# EAGLE schematic rc_filter_v1-xld50 (EAGLE 9.3.0)
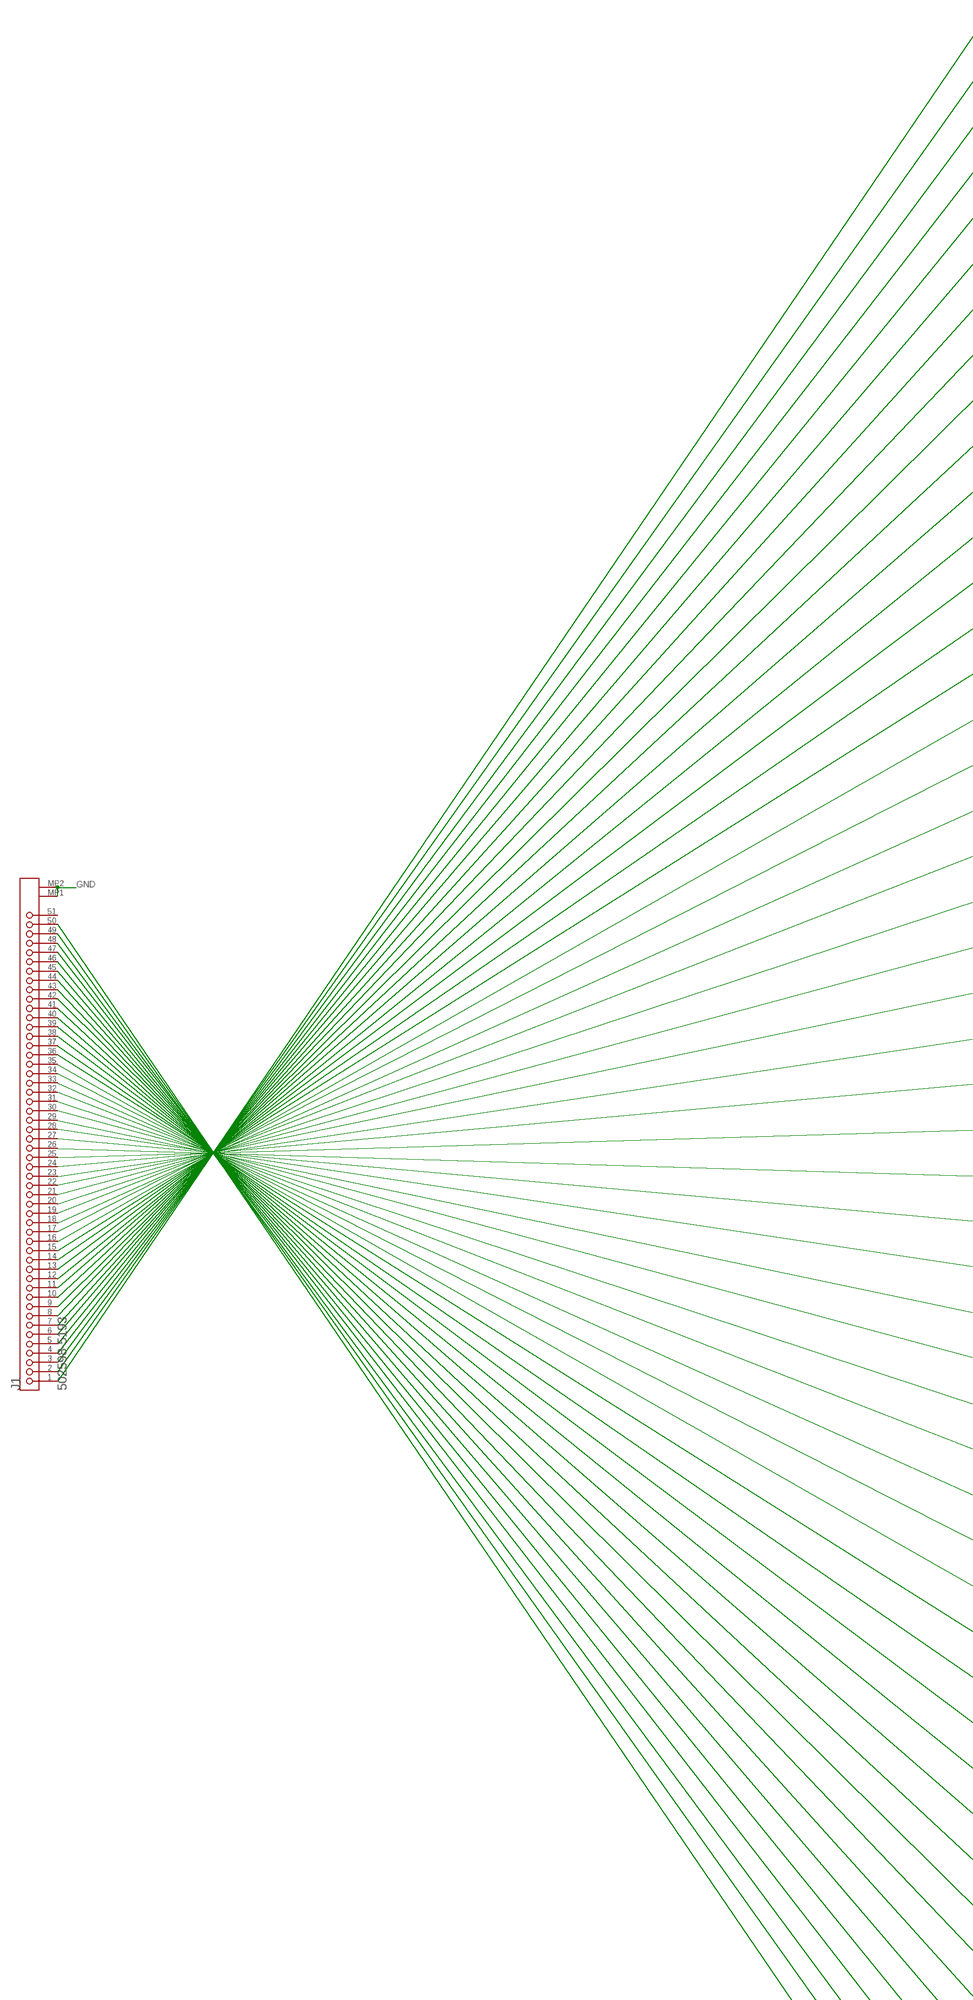
[diagram p0: schematic, sheet 1, part 1 of 3]
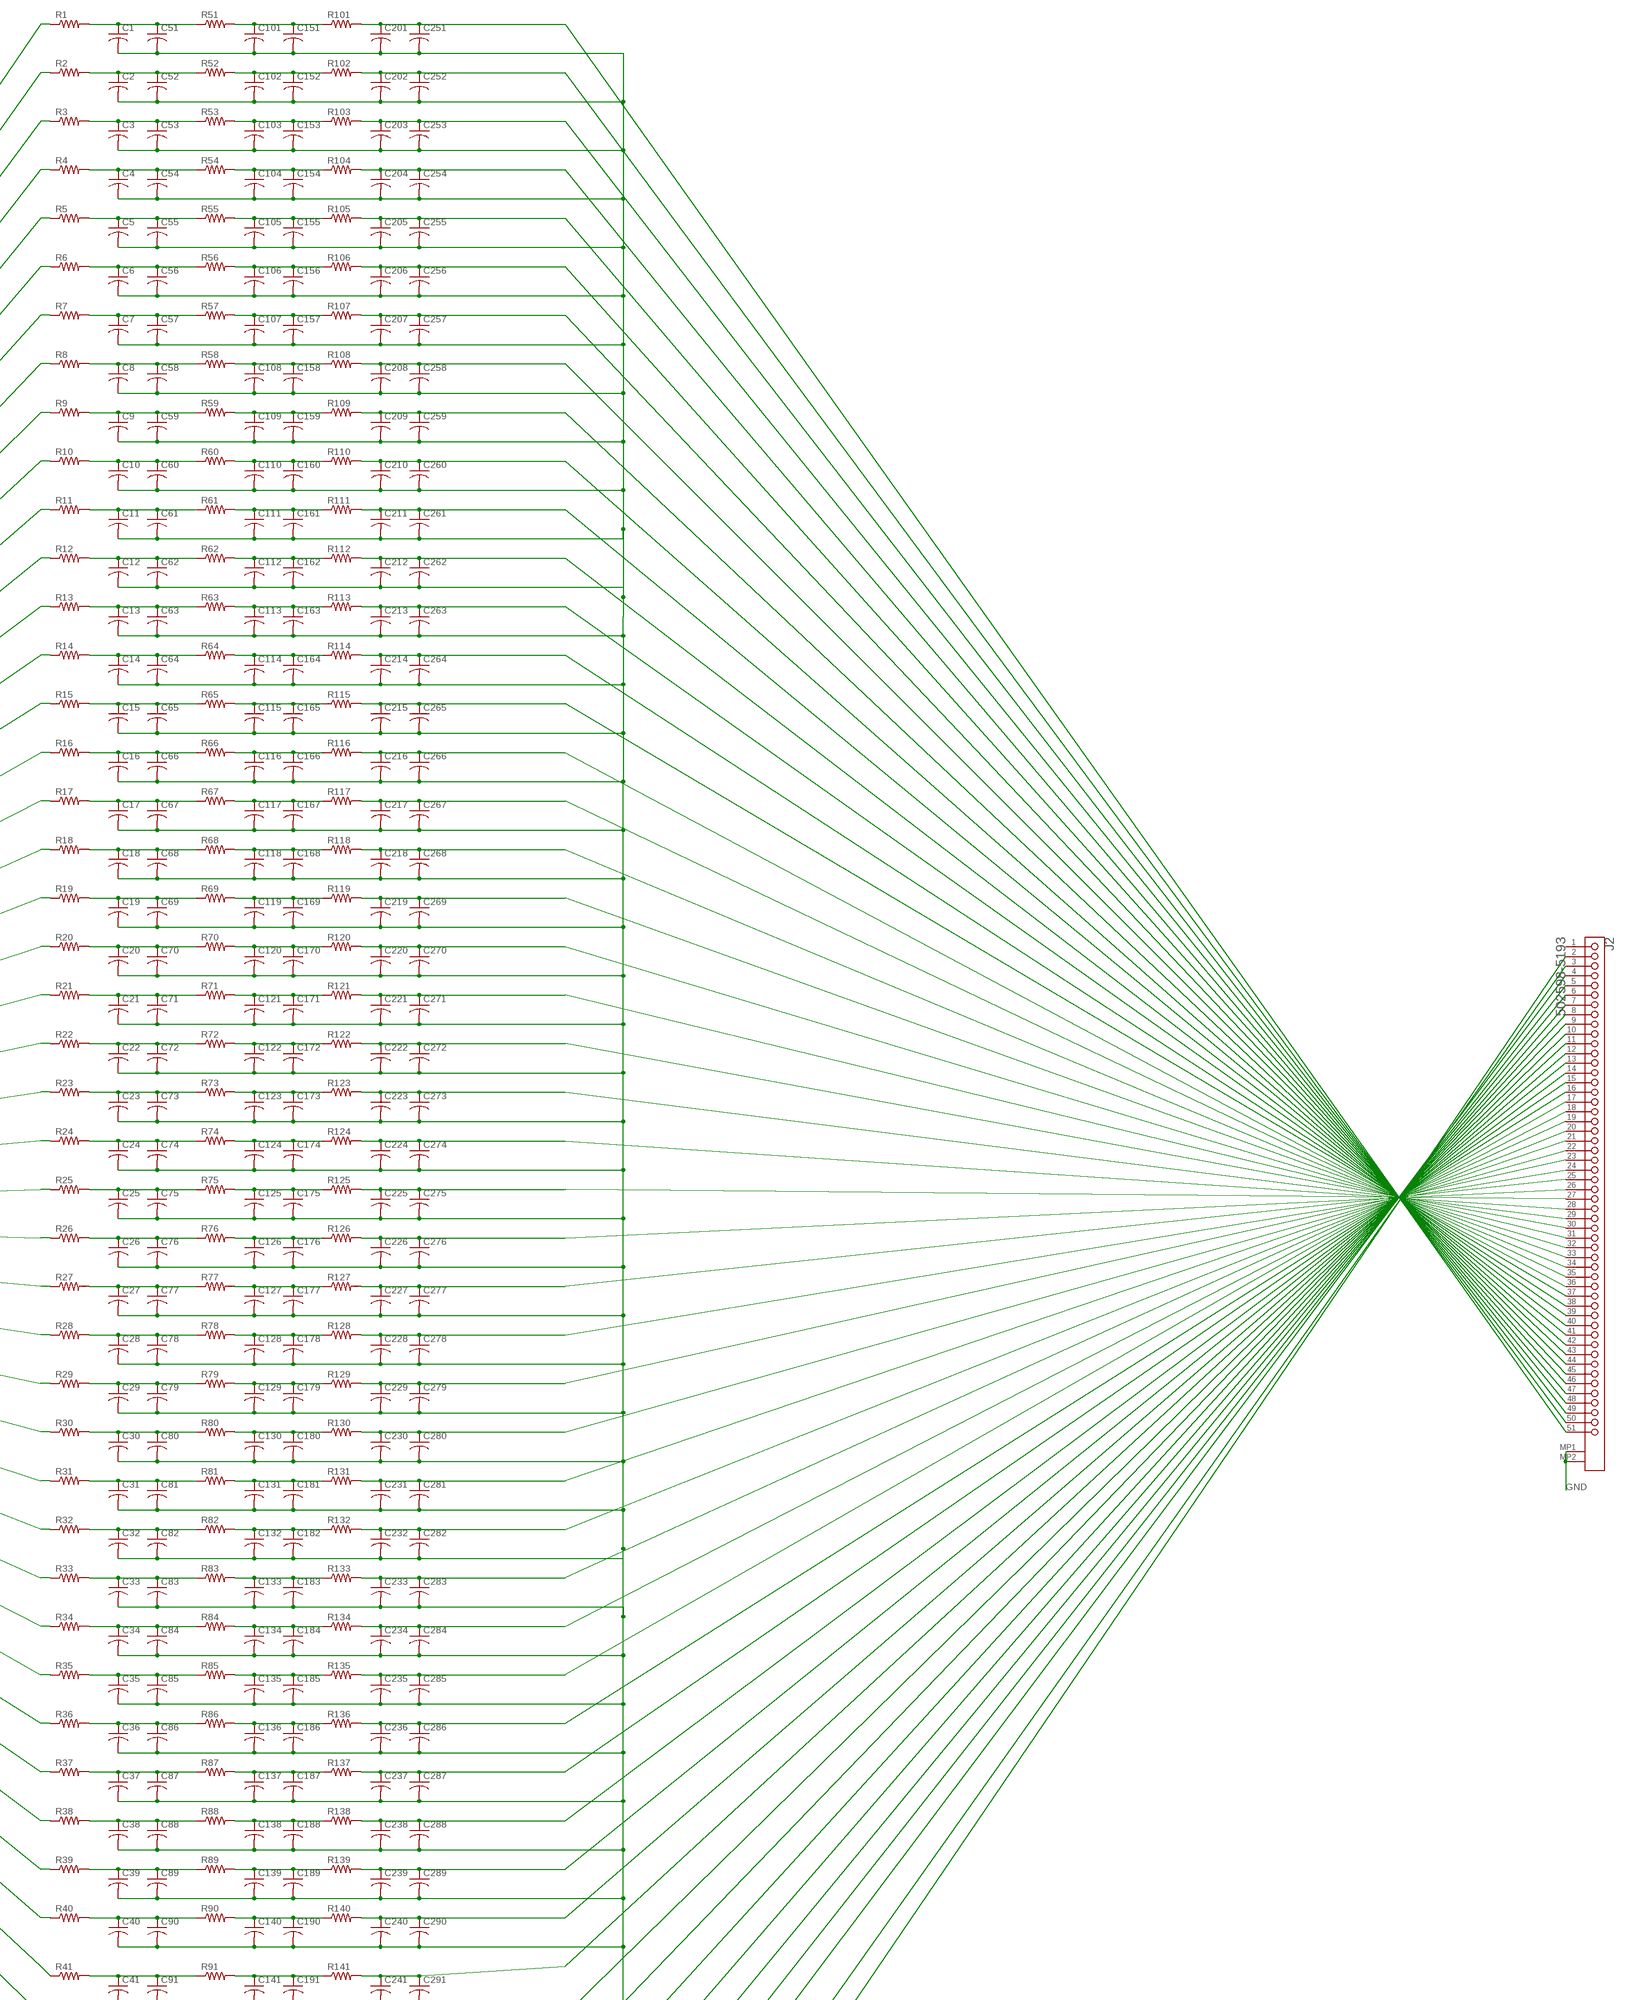
[diagram p1: schematic, sheet 1, part 2 of 3]
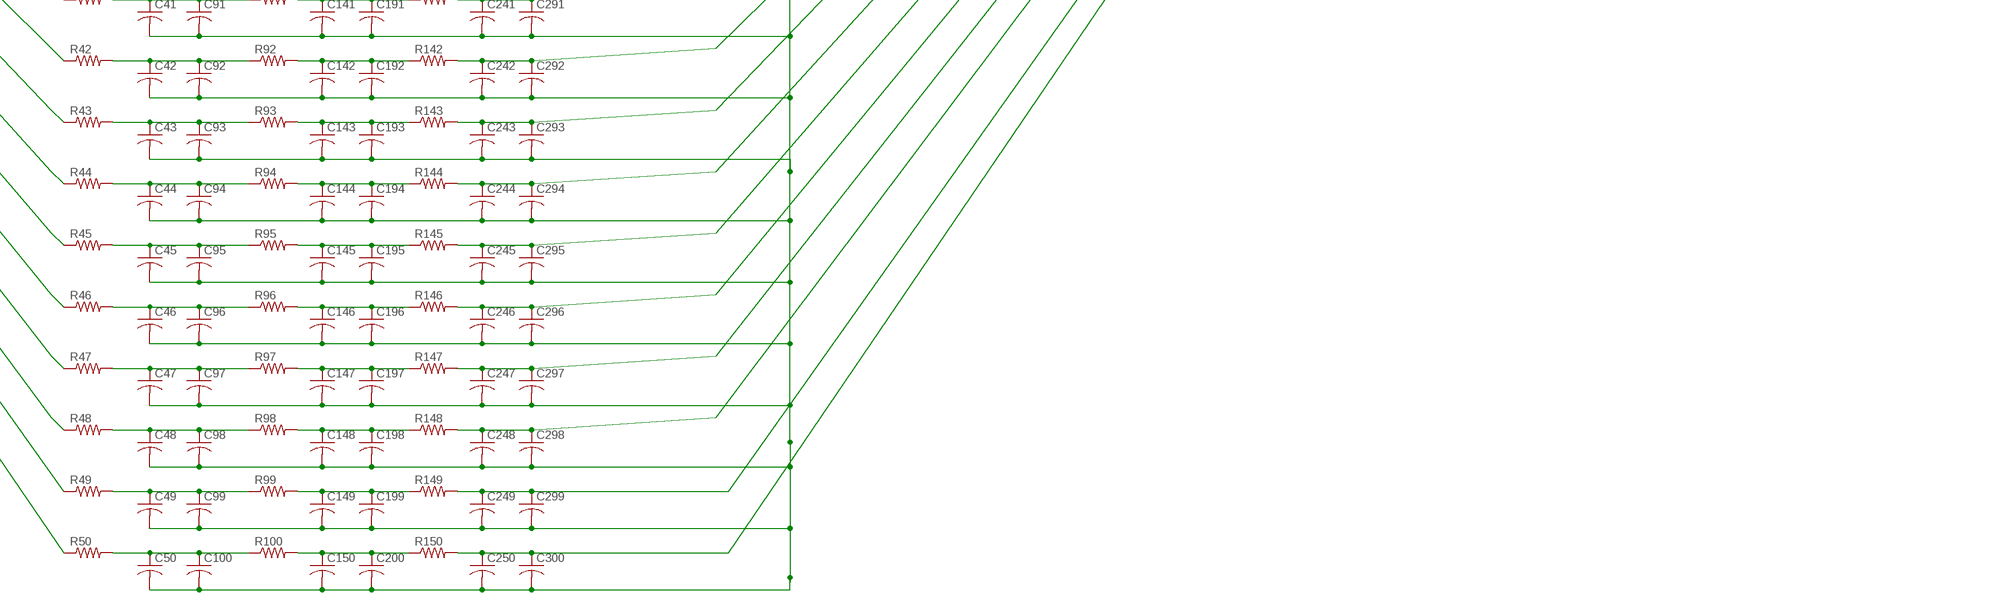
[diagram p2: schematic, sheet 1, part 3 of 3]

## Parts
C1  C-USC0402  [C0402]
C2  C-USC0402  [C0402]
C3  C-USC0402  [C0402]
C4  C-USC0402  [C0402]
C5  C-USC0402  [C0402]
C6  C-USC0402  [C0402]
C7  C-USC0402  [C0402]
C8  C-USC0402  [C0402]
C9  C-USC0402  [C0402]
C10  C-USC0402  [C0402]
C11  C-USC0402  [C0402]
C12  C-USC0402  [C0402]
C13  C-USC0402  [C0402]
C14  C-USC0402  [C0402]
C15  C-USC0402  [C0402]
C16  C-USC0402  [C0402]
C17  C-USC0402  [C0402]
C18  C-USC0402  [C0402]
C19  C-USC0402  [C0402]
C20  C-USC0402  [C0402]
C21  C-USC0402  [C0402]
C22  C-USC0402  [C0402]
C23  C-USC0402  [C0402]
C24  C-USC0402  [C0402]
C25  C-USC0402  [C0402]
C26  C-USC0402  [C0402]
C27  C-USC0402  [C0402]
C28  C-USC0402  [C0402]
C29  C-USC0402  [C0402]
C30  C-USC0402  [C0402]
C31  C-USC0402  [C0402]
C32  C-USC0402  [C0402]
C33  C-USC0402  [C0402]
C34  C-USC0402  [C0402]
C35  C-USC0402  [C0402]
C36  C-USC0402  [C0402]
C37  C-USC0402  [C0402]
C38  C-USC0402  [C0402]
C39  C-USC0402  [C0402]
C40  C-USC0402  [C0402]
C41  C-USC0402  [C0402]
C42  C-USC0402  [C0402]
C43  C-USC0402  [C0402]
C44  C-USC0402  [C0402]
C45  C-USC0402  [C0402]
C46  C-USC0402  [C0402]
C47  C-USC0402  [C0402]
C48  C-USC0402  [C0402]
C49  C-USC0402  [C0402]
C50  C-USC0402  [C0402]
C51  C-USC0402  [C0402]
C52  C-USC0402  [C0402]
C53  C-USC0402  [C0402]
C54  C-USC0402  [C0402]
C55  C-USC0402  [C0402]
C56  C-USC0402  [C0402]
C57  C-USC0402  [C0402]
C58  C-USC0402  [C0402]
C59  C-USC0402  [C0402]
C60  C-USC0402  [C0402]
C61  C-USC0402  [C0402]
C62  C-USC0402  [C0402]
C63  C-USC0402  [C0402]
C64  C-USC0402  [C0402]
C65  C-USC0402  [C0402]
C66  C-USC0402  [C0402]
C67  C-USC0402  [C0402]
C68  C-USC0402  [C0402]
C69  C-USC0402  [C0402]
C70  C-USC0402  [C0402]
C71  C-USC0402  [C0402]
C72  C-USC0402  [C0402]
C73  C-USC0402  [C0402]
C74  C-USC0402  [C0402]
C75  C-USC0402  [C0402]
C76  C-USC0402  [C0402]
C77  C-USC0402  [C0402]
C78  C-USC0402  [C0402]
C79  C-USC0402  [C0402]
C80  C-USC0402  [C0402]
C81  C-USC0402  [C0402]
C82  C-USC0402  [C0402]
C83  C-USC0402  [C0402]
C84  C-USC0402  [C0402]
C85  C-USC0402  [C0402]
C86  C-USC0402  [C0402]
C87  C-USC0402  [C0402]
C88  C-USC0402  [C0402]
C89  C-USC0402  [C0402]
C90  C-USC0402  [C0402]
C91  C-USC0402  [C0402]
C92  C-USC0402  [C0402]
C93  C-USC0402  [C0402]
C94  C-USC0402  [C0402]
C95  C-USC0402  [C0402]
C96  C-USC0402  [C0402]
C97  C-USC0402  [C0402]
C98  C-USC0402  [C0402]
C99  C-USC0402  [C0402]
C100  C-USC0402  [C0402]
C101  C-USC0402  [C0402]
C102  C-USC0402  [C0402]
C103  C-USC0402  [C0402]
C104  C-USC0402  [C0402]
C105  C-USC0402  [C0402]
C106  C-USC0402  [C0402]
C107  C-USC0402  [C0402]
C108  C-USC0402  [C0402]
C109  C-USC0402  [C0402]
C110  C-USC0402  [C0402]
C111  C-USC0402  [C0402]
C112  C-USC0402  [C0402]
C113  C-USC0402  [C0402]
C114  C-USC0402  [C0402]
C115  C-USC0402  [C0402]
C116  C-USC0402  [C0402]
C117  C-USC0402  [C0402]
C118  C-USC0402  [C0402]
C119  C-USC0402  [C0402]
C120  C-USC0402  [C0402]
C121  C-USC0402  [C0402]
C122  C-USC0402  [C0402]
C123  C-USC0402  [C0402]
C124  C-USC0402  [C0402]
C125  C-USC0402  [C0402]
C126  C-USC0402  [C0402]
C127  C-USC0402  [C0402]
C128  C-USC0402  [C0402]
C129  C-USC0402  [C0402]
C130  C-USC0402  [C0402]
C131  C-USC0402  [C0402]
C132  C-USC0402  [C0402]
C133  C-USC0402  [C0402]
C134  C-USC0402  [C0402]
C135  C-USC0402  [C0402]
C136  C-USC0402  [C0402]
C137  C-USC0402  [C0402]
C138  C-USC0402  [C0402]
C139  C-USC0402  [C0402]
C140  C-USC0402  [C0402]
C141  C-USC0402  [C0402]
C142  C-USC0402  [C0402]
C143  C-USC0402  [C0402]
C144  C-USC0402  [C0402]
C145  C-USC0402  [C0402]
C146  C-USC0402  [C0402]
C147  C-USC0402  [C0402]
C148  C-USC0402  [C0402]
C149  C-USC0402  [C0402]
C150  C-USC0402  [C0402]
C151  C-USC0402  [C0402]
C152  C-USC0402  [C0402]
C153  C-USC0402  [C0402]
C154  C-USC0402  [C0402]
C155  C-USC0402  [C0402]
C156  C-USC0402  [C0402]
C157  C-USC0402  [C0402]
C158  C-USC0402  [C0402]
C159  C-USC0402  [C0402]
C160  C-USC0402  [C0402]
C161  C-USC0402  [C0402]
C162  C-USC0402  [C0402]
C163  C-USC0402  [C0402]
C164  C-USC0402  [C0402]
C165  C-USC0402  [C0402]
C166  C-USC0402  [C0402]
C167  C-USC0402  [C0402]
C168  C-USC0402  [C0402]
C169  C-USC0402  [C0402]
C170  C-USC0402  [C0402]
C171  C-USC0402  [C0402]
C172  C-USC0402  [C0402]
C173  C-USC0402  [C0402]
C174  C-USC0402  [C0402]
C175  C-USC0402  [C0402]
C176  C-USC0402  [C0402]
C177  C-USC0402  [C0402]
C178  C-USC0402  [C0402]
C179  C-USC0402  [C0402]
C180  C-USC0402  [C0402]
C181  C-USC0402  [C0402]
C182  C-USC0402  [C0402]
C183  C-USC0402  [C0402]
C184  C-USC0402  [C0402]
C185  C-USC0402  [C0402]
C186  C-USC0402  [C0402]
C187  C-USC0402  [C0402]
C188  C-USC0402  [C0402]
C189  C-USC0402  [C0402]
C190  C-USC0402  [C0402]
C191  C-USC0402  [C0402]
C192  C-USC0402  [C0402]
C193  C-USC0402  [C0402]
C194  C-USC0402  [C0402]
C195  C-USC0402  [C0402]
C196  C-USC0402  [C0402]
C197  C-USC0402  [C0402]
C198  C-USC0402  [C0402]
C199  C-USC0402  [C0402]
C200  C-USC0402  [C0402]
C201  C-USC0402  [C0402]
C202  C-USC0402  [C0402]
C203  C-USC0402  [C0402]
C204  C-USC0402  [C0402]
C205  C-USC0402  [C0402]
C206  C-USC0402  [C0402]
C207  C-USC0402  [C0402]
C208  C-USC0402  [C0402]
C209  C-USC0402  [C0402]
C210  C-USC0402  [C0402]
C211  C-USC0402  [C0402]
C212  C-USC0402  [C0402]
C213  C-USC0402  [C0402]
C214  C-USC0402  [C0402]
C215  C-USC0402  [C0402]
C216  C-USC0402  [C0402]
C217  C-USC0402  [C0402]
C218  C-USC0402  [C0402]
C219  C-USC0402  [C0402]
C220  C-USC0402  [C0402]
C221  C-USC0402  [C0402]
C222  C-USC0402  [C0402]
C223  C-USC0402  [C0402]
C224  C-USC0402  [C0402]
C225  C-USC0402  [C0402]
C226  C-USC0402  [C0402]
C227  C-USC0402  [C0402]
C228  C-USC0402  [C0402]
C229  C-USC0402  [C0402]
C230  C-USC0402  [C0402]
C231  C-USC0402  [C0402]
C232  C-USC0402  [C0402]
C233  C-USC0402  [C0402]
C234  C-USC0402  [C0402]
C235  C-USC0402  [C0402]
C236  C-USC0402  [C0402]
C237  C-USC0402  [C0402]
C238  C-USC0402  [C0402]
C239  C-USC0402  [C0402]
C240  C-USC0402  [C0402]
C241  C-USC0402  [C0402]
C242  C-USC0402  [C0402]
C243  C-USC0402  [C0402]
C244  C-USC0402  [C0402]
C245  C-USC0402  [C0402]
C246  C-USC0402  [C0402]
C247  C-USC0402  [C0402]
C248  C-USC0402  [C0402]
C249  C-USC0402  [C0402]
C250  C-USC0402  [C0402]
C251  C-USC0402  [C0402]
C252  C-USC0402  [C0402]
C253  C-USC0402  [C0402]
C254  C-USC0402  [C0402]
C255  C-USC0402  [C0402]
C256  C-USC0402  [C0402]
C257  C-USC0402  [C0402]
C258  C-USC0402  [C0402]
C259  C-USC0402  [C0402]
C260  C-USC0402  [C0402]
C261  C-USC0402  [C0402]
C262  C-USC0402  [C0402]
C263  C-USC0402  [C0402]
C264  C-USC0402  [C0402]
C265  C-USC0402  [C0402]
C266  C-USC0402  [C0402]
C267  C-USC0402  [C0402]
C268  C-USC0402  [C0402]
C269  C-USC0402  [C0402]
C270  C-USC0402  [C0402]
C271  C-USC0402  [C0402]
C272  C-USC0402  [C0402]
C273  C-USC0402  [C0402]
C274  C-USC0402  [C0402]
C275  C-USC0402  [C0402]
C276  C-USC0402  [C0402]
C277  C-USC0402  [C0402]
C278  C-USC0402  [C0402]
C279  C-USC0402  [C0402]
C280  C-USC0402  [C0402]
C281  C-USC0402  [C0402]
C282  C-USC0402  [C0402]
C283  C-USC0402  [C0402]
C284  C-USC0402  [C0402]
C285  C-USC0402  [C0402]
C286  C-USC0402  [C0402]
C287  C-USC0402  [C0402]
C288  C-USC0402  [C0402]
C289  C-USC0402  [C0402]
C290  C-USC0402  [C0402]
C291  C-USC0402  [C0402]
C292  C-USC0402  [C0402]
C293  C-USC0402  [C0402]
C294  C-USC0402  [C0402]
C295  C-USC0402  [C0402]
C296  C-USC0402  [C0402]
C297  C-USC0402  [C0402]
C298  C-USC0402  [C0402]
C299  C-USC0402  [C0402]
C300  C-USC0402  [C0402]
J1  MOLEX_502598-5193MOLEX_502598-5193_0_0  [MOLEX_502598-5193_0]
J2  MOLEX_502598-5193MOLEX_502598-5193_0_0  [MOLEX_502598-5193_0]
R1  R-US_R0402  [R0402]
R2  R-US_R0402  [R0402]
R3  R-US_R0402  [R0402]
R4  R-US_R0402  [R0402]
R5  R-US_R0402  [R0402]
R6  R-US_R0402  [R0402]
R7  R-US_R0402  [R0402]
R8  R-US_R0402  [R0402]
R9  R-US_R0402  [R0402]
R10  R-US_R0402  [R0402]
R11  R-US_R0402  [R0402]
R12  R-US_R0402  [R0402]
R13  R-US_R0402  [R0402]
R14  R-US_R0402  [R0402]
R15  R-US_R0402  [R0402]
R16  R-US_R0402  [R0402]
R17  R-US_R0402  [R0402]
R18  R-US_R0402  [R0402]
R19  R-US_R0402  [R0402]
R20  R-US_R0402  [R0402]
R21  R-US_R0402  [R0402]
R22  R-US_R0402  [R0402]
R23  R-US_R0402  [R0402]
R24  R-US_R0402  [R0402]
R25  R-US_R0402  [R0402]
R26  R-US_R0402  [R0402]
R27  R-US_R0402  [R0402]
R28  R-US_R0402  [R0402]
R29  R-US_R0402  [R0402]
R30  R-US_R0402  [R0402]
R31  R-US_R0402  [R0402]
R32  R-US_R0402  [R0402]
R33  R-US_R0402  [R0402]
R34  R-US_R0402  [R0402]
R35  R-US_R0402  [R0402]
R36  R-US_R0402  [R0402]
R37  R-US_R0402  [R0402]
R38  R-US_R0402  [R0402]
R39  R-US_R0402  [R0402]
R40  R-US_R0402  [R0402]
R41  R-US_R0402  [R0402]
R42  R-US_R0402  [R0402]
R43  R-US_R0402  [R0402]
R44  R-US_R0402  [R0402]
R45  R-US_R0402  [R0402]
R46  R-US_R0402  [R0402]
R47  R-US_R0402  [R0402]
R48  R-US_R0402  [R0402]
R49  R-US_R0402  [R0402]
R50  R-US_R0402  [R0402]
R51  R-US_R0402  [R0402]
R52  R-US_R0402  [R0402]
R53  R-US_R0402  [R0402]
R54  R-US_R0402  [R0402]
R55  R-US_R0402  [R0402]
R56  R-US_R0402  [R0402]
R57  R-US_R0402  [R0402]
R58  R-US_R0402  [R0402]
R59  R-US_R0402  [R0402]
R60  R-US_R0402  [R0402]
R61  R-US_R0402  [R0402]
R62  R-US_R0402  [R0402]
R63  R-US_R0402  [R0402]
R64  R-US_R0402  [R0402]
R65  R-US_R0402  [R0402]
R66  R-US_R0402  [R0402]
R67  R-US_R0402  [R0402]
R68  R-US_R0402  [R0402]
R69  R-US_R0402  [R0402]
R70  R-US_R0402  [R0402]
R71  R-US_R0402  [R0402]
R72  R-US_R0402  [R0402]
R73  R-US_R0402  [R0402]
R74  R-US_R0402  [R0402]
R75  R-US_R0402  [R0402]
R76  R-US_R0402  [R0402]
R77  R-US_R0402  [R0402]
R78  R-US_R0402  [R0402]
R79  R-US_R0402  [R0402]
R80  R-US_R0402  [R0402]
R81  R-US_R0402  [R0402]
R82  R-US_R0402  [R0402]
R83  R-US_R0402  [R0402]
R84  R-US_R0402  [R0402]
R85  R-US_R0402  [R0402]
R86  R-US_R0402  [R0402]
R87  R-US_R0402  [R0402]
R88  R-US_R0402  [R0402]
R89  R-US_R0402  [R0402]
R90  R-US_R0402  [R0402]
R91  R-US_R0402  [R0402]
R92  R-US_R0402  [R0402]
R93  R-US_R0402  [R0402]
R94  R-US_R0402  [R0402]
R95  R-US_R0402  [R0402]
R96  R-US_R0402  [R0402]
R97  R-US_R0402  [R0402]
R98  R-US_R0402  [R0402]
R99  R-US_R0402  [R0402]
R100  R-US_R0402  [R0402]
R101  R-US_R0402  [R0402]
R102  R-US_R0402  [R0402]
R103  R-US_R0402  [R0402]
R104  R-US_R0402  [R0402]
R105  R-US_R0402  [R0402]
R106  R-US_R0402  [R0402]
R107  R-US_R0402  [R0402]
R108  R-US_R0402  [R0402]
R109  R-US_R0402  [R0402]
R110  R-US_R0402  [R0402]
R111  R-US_R0402  [R0402]
R112  R-US_R0402  [R0402]
R113  R-US_R0402  [R0402]
R114  R-US_R0402  [R0402]
R115  R-US_R0402  [R0402]
R116  R-US_R0402  [R0402]
R117  R-US_R0402  [R0402]
R118  R-US_R0402  [R0402]
R119  R-US_R0402  [R0402]
R120  R-US_R0402  [R0402]
R121  R-US_R0402  [R0402]
R122  R-US_R0402  [R0402]
R123  R-US_R0402  [R0402]
R124  R-US_R0402  [R0402]
R125  R-US_R0402  [R0402]
R126  R-US_R0402  [R0402]
R127  R-US_R0402  [R0402]
R128  R-US_R0402  [R0402]
R129  R-US_R0402  [R0402]
R130  R-US_R0402  [R0402]
R131  R-US_R0402  [R0402]
R132  R-US_R0402  [R0402]
R133  R-US_R0402  [R0402]
R134  R-US_R0402  [R0402]
R135  R-US_R0402  [R0402]
R136  R-US_R0402  [R0402]
R137  R-US_R0402  [R0402]
R138  R-US_R0402  [R0402]
R139  R-US_R0402  [R0402]
R140  R-US_R0402  [R0402]
R141  R-US_R0402  [R0402]
R142  R-US_R0402  [R0402]
R143  R-US_R0402  [R0402]
R144  R-US_R0402  [R0402]
R145  R-US_R0402  [R0402]
R146  R-US_R0402  [R0402]
R147  R-US_R0402  [R0402]
R148  R-US_R0402  [R0402]
R149  R-US_R0402  [R0402]
R150  R-US_R0402  [R0402]

## Nets
F1: J1.1 R1.1
F2: J1.2 R2.1
F3: J1.3 R3.1
F4: J1.4 R4.1
F5: J1.5 R5.1
F6: J1.6 R6.1
F7: J1.7 R7.1
F8: J1.8 R8.1
F9: J1.9 R9.1
F10: J1.10 R10.1
F11: J1.11 R11.1
F12: J1.12 R12.1
F13: J1.13 R13.1
F14: J1.14 R14.1
F15: J1.15 R15.1
F16: J1.16 R16.1
F17: J1.17 R17.1
F18: J1.18 R18.1
F19: J1.19 R19.1
F20: J1.20 R20.1
F21: J1.21 R21.1
F22: J1.22 R22.1
F23: J1.23 R23.1
F24: J1.24 R24.1
F25: J1.25 R25.1
F26: J1.26 R26.1
F27: J1.27 R27.1
F28: J1.28 R28.1
F29: J1.29 R29.1
F30: J1.30 R30.1
F31: J1.31 R31.1
F32: J1.32 R32.1
F33: J1.33 R33.1
F34: J1.34 R34.1
F35: J1.35 R35.1
F36: J1.36 R36.1
F37: J1.37 R37.1
F38: J1.38 R38.1
F39: J1.39 R39.1
F40: J1.40 R40.1
F41: J1.41 R41.1
F42: J1.42 R42.1
F43: J1.43 R43.1
F44: J1.44 R44.1
F45: J1.45 R45.1
F46: J1.46 R46.1
F47: J1.47 R47.1
F48: J1.48 R48.1
F49: J1.49 R49.1
F50: J1.50 R50.1
G1: C201.1 C251.1 J2.51 R101.2
G2: C202.1 C252.1 J2.50 R102.2
G3: C203.1 C253.1 J2.49 R103.2
G4: C204.1 C254.1 J2.48 R104.2
G5: C205.1 C255.1 J2.47 R105.2
G6: C206.1 C256.1 J2.46 R106.2
G7: C207.1 C257.1 J2.45 R107.2
G8: C208.1 C258.1 J2.44 R108.2
G9: C209.1 C259.1 J2.43 R109.2
G10: C210.1 C260.1 J2.42 R110.2
G11: C211.1 C261.1 J2.41 R111.2
G12: C212.1 C262.1 J2.40 R112.2
G13: C213.1 C263.1 J2.39 R113.2
G14: C214.1 C264.1 J2.38 R114.2
G15: C215.1 C265.1 J2.37 R115.2
G16: C216.1 C266.1 J2.36 R116.2
G17: C217.1 C267.1 J2.35 R117.2
G18: C218.1 C268.1 J2.34 R118.2
G19: C219.1 C269.1 J2.33 R119.2
G20: C220.1 C270.1 J2.32 R120.2
G21: C221.1 C271.1 J2.31 R121.2
G22: C222.1 C272.1 J2.30 R122.2
G23: C223.1 C273.1 J2.29 R123.2
G24: C224.1 C274.1 J2.28 R124.2
G25: C225.1 C275.1 J2.27 R125.2
G26: C226.1 C276.1 J2.26 R126.2
G27: C227.1 C277.1 J2.25 R127.2
G28: C228.1 C278.1 J2.24 R128.2
G29: C229.1 C279.1 J2.23 R129.2
G30: C230.1 C280.1 J2.22 R130.2
G31: C231.1 C281.1 J2.21 R131.2
G32: C232.1 C282.1 J2.20 R132.2
G33: C233.1 C283.1 J2.19 R133.2
G34: C234.1 C284.1 J2.18 R134.2
G35: C235.1 C285.1 J2.17 R135.2
G36: C236.1 C286.1 J2.16 R136.2
G37: C237.1 C287.1 J2.15 R137.2
G38: C238.1 C288.1 J2.14 R138.2
G39: C239.1 C289.1 J2.13 R139.2
G40: C240.1 C290.1 J2.12 R140.2
G41: C241.1 C291.1 J2.11 R141.2
G42: C242.1 C292.1 J2.10 R142.2
G43: C243.1 C293.1 J2.9 R143.2
G44: C244.1 C294.1 J2.8 R144.2
G45: C245.1 C295.1 J2.7 R145.2
G46: C246.1 C296.1 J2.6 R146.2
G47: C247.1 C297.1 J2.5 R147.2
G48: C248.1 C298.1 J2.4 R148.2
G49: C249.1 C299.1 J2.3 R149.2
G50: C250.1 C300.1 J2.2 R150.2
GND: C1.2 C2.2 C3.2 C4.2 C5.2 C6.2 C7.2 C8.2 C9.2 C10.2 C11.2 C12.2 C13.2 C14.2 C15.2 C16.2 C17.2 C18.2 C19.2 C20.2 C21.2 C22.2 C23.2 C24.2 C25.2 C26.2 C27.2 C28.2 C29.2 C30.2 C31.2 C32.2 C33.2 C34.2 C35.2 C36.2 C37.2 C38.2 C39.2 C40.2 C41.2 C42.2 C43.2 C44.2 C45.2 C46.2 C47.2 C48.2 C49.2 C50.2 C51.2 C52.2 C53.2 C54.2 C55.2 C56.2 C57.2 C58.2 C59.2 C60.2 C61.2 C62.2 C63.2 C64.2 C65.2 C66.2 C67.2 C68.2 C69.2 C70.2 C71.2 C72.2 C73.2 C74.2 C75.2 C76.2 C77.2 C78.2 C79.2 C80.2 C81.2 C82.2 C83.2 C84.2 C85.2 C86.2 C87.2 C88.2 C89.2 C90.2 C91.2 C92.2 C93.2 C94.2 C95.2 C96.2 C97.2 C98.2 C99.2 C100.2 C101.2 C102.2 C103.2 C104.2 C105.2 C106.2 C107.2 C108.2 C109.2 C110.2 C111.2 C112.2 C113.2 C114.2 C115.2 C116.2 C117.2 C118.2 C119.2 C120.2 C121.2 C122.2 C123.2 C124.2 C125.2 C126.2 C127.2 C128.2 C129.2 C130.2 C131.2 C132.2 C133.2 C134.2 C135.2 C136.2 C137.2 C138.2 C139.2 C140.2 C141.2 C142.2 C143.2 C144.2 C145.2 C146.2 C147.2 C148.2 C149.2 C150.2 C151.2 C152.2 C153.2 C154.2 C155.2 C156.2 C157.2 C158.2 C159.2 C160.2 C161.2 C162.2 C163.2 C164.2 C165.2 C166.2 C167.2 C168.2 C169.2 C170.2 C171.2 C172.2 C173.2 C174.2 C175.2 C176.2 C177.2 C178.2 C179.2 C180.2 C181.2 C182.2 C183.2 C184.2 C185.2 C186.2 C187.2 C188.2 C189.2 C190.2 C191.2 C192.2 C193.2 C194.2 C195.2 C196.2 C197.2 C198.2 C199.2 C200.2 C201.2 C202.2 C203.2 C204.2 C205.2 C206.2 C207.2 C208.2 C209.2 C210.2 C211.2 C212.2 C213.2 C214.2 C215.2 C216.2 C217.2 C218.2 C219.2 C220.2 C221.2 C222.2 C223.2 C224.2 C225.2 C226.2 C227.2 C228.2 C229.2 C230.2 C231.2 C232.2 C233.2 C234.2 C235.2 C236.2 C237.2 C238.2 C239.2 C240.2 C241.2 C242.2 C243.2 C244.2 C245.2 C246.2 C247.2 C248.2 C249.2 C250.2 C251.2 C252.2 C253.2 C254.2 C255.2 C256.2 C257.2 C258.2 C259.2 C260.2 C261.2 C262.2 C263.2 C264.2 C265.2 C266.2 C267.2 C268.2 C269.2 C270.2 C271.2 C272.2 C273.2 C274.2 C275.2 C276.2 C277.2 C278.2 C279.2 C280.2 C281.2 C282.2 C283.2 C284.2 C285.2 C286.2 C287.2 C288.2 C289.2 C290.2 C291.2 C292.2 C293.2 C294.2 C295.2 C296.2 C297.2 C298.2 C299.2 C300.2 J1.MP1 J1.MP2 J2.MP1 J2.MP2
N$1: C4.1 C54.1 R4.2 R54.1
N$2: C104.1 C154.1 R54.2 R104.1
N$7: C3.1 C53.1 R3.2 R53.1
N$8: C103.1 C153.1 R53.2 R103.1
N$12: C6.1 C56.1 R6.2 R56.1
N$14: C106.1 C156.1 R56.2 R106.1
N$18: C5.1 C55.1 R5.2 R55.1
N$19: C105.1 C155.1 R55.2 R105.1
N$24: C8.1 C58.1 R8.2 R58.1
N$26: C108.1 C158.1 R58.2 R108.1
N$30: C7.1 C57.1 R7.2 R57.1
N$32: C107.1 C157.1 R57.2 R107.1
N$36: C10.1 C60.1 R10.2 R60.1
N$38: C110.1 C160.1 R60.2 R110.1
N$43: C9.1 C59.1 R9.2 R59.1
N$44: C109.1 C159.1 R59.2 R109.1
N$46: C2.1 C52.1 R2.2 R52.1
N$47: C102.1 C152.1 R52.2 R102.1
N$53: C1.1 C51.1 R1.2 R51.1
N$54: C101.1 C151.1 R51.2 R101.1
N$66: C12.1 C62.1 R12.2 R62.1
N$67: C112.1 C162.1 R62.2 R112.1
N$70: C11.1 C61.1 R11.2 R61.1
N$71: C111.1 C161.1 R61.2 R111.1
N$74: C14.1 C64.1 R14.2 R64.1
N$75: C114.1 C164.1 R64.2 R114.1
N$78: C13.1 C63.1 R13.2 R63.1
N$79: C113.1 C163.1 R63.2 R113.1
N$82: C16.1 C66.1 R16.2 R66.1
N$83: C116.1 C166.1 R66.2 R116.1
N$86: C15.1 C65.1 R15.2 R65.1
N$87: C115.1 C165.1 R65.2 R115.1
N$90: C18.1 C68.1 R18.2 R68.1
N$91: C118.1 C168.1 R68.2 R118.1
N$94: C17.1 C67.1 R17.2 R67.1
N$95: C117.1 C167.1 R67.2 R117.1
N$98: C20.1 C70.1 R20.2 R70.1
N$99: C120.1 C170.1 R70.2 R120.1
N$102: C19.1 C69.1 R19.2 R69.1
N$103: C119.1 C169.1 R69.2 R119.1
N$106: C42.1 C92.1 R42.2 R92.1
N$107: C142.1 C192.1 R92.2 R142.1
N$110: C41.1 C91.1 R41.2 R91.1
N$111: C141.1 C191.1 R91.2 R141.1
N$114: C44.1 C94.1 R44.2 R94.1
N$115: C144.1 C194.1 R94.2 R144.1
N$118: C43.1 C93.1 R43.2 R93.1
N$119: C143.1 C193.1 R93.2 R143.1
N$122: C46.1 C96.1 R46.2 R96.1
N$123: C146.1 C196.1 R96.2 R146.1
N$126: C45.1 C95.1 R45.2 R95.1
N$127: C145.1 C195.1 R95.2 R145.1
N$130: C48.1 C98.1 R48.2 R98.1
N$131: C148.1 C198.1 R98.2 R148.1
N$134: C47.1 C97.1 R47.2 R97.1
N$135: C147.1 C197.1 R97.2 R147.1
N$138: C50.1 C100.1 R50.2 R100.1
N$139: C150.1 C200.1 R100.2 R150.1
N$142: C49.1 C99.1 R49.2 R99.1
N$143: C149.1 C199.1 R99.2 R149.1
N$146: C32.1 C82.1 R32.2 R82.1
N$147: C132.1 C182.1 R82.2 R132.1
N$150: C31.1 C81.1 R31.2 R81.1
N$151: C131.1 C181.1 R81.2 R131.1
N$154: C34.1 C84.1 R34.2 R84.1
N$155: C134.1 C184.1 R84.2 R134.1
N$160: C33.1 C83.1 R33.2 R83.1
N$161: C133.1 C183.1 R83.2 R133.1
N$164: C36.1 C86.1 R36.2 R86.1
N$165: C136.1 C186.1 R86.2 R136.1
N$168: C35.1 C85.1 R35.2 R85.1
N$169: C135.1 C185.1 R85.2 R135.1
N$172: C38.1 C88.1 R38.2 R88.1
N$173: C138.1 C188.1 R88.2 R138.1
N$176: C37.1 C87.1 R37.2 R87.1
N$177: C137.1 C187.1 R87.2 R137.1
N$180: C40.1 C90.1 R40.2 R90.1
N$181: C140.1 C190.1 R90.2 R140.1
N$184: C39.1 C89.1 R39.2 R89.1
N$185: C139.1 C189.1 R89.2 R139.1
N$188: C22.1 C72.1 R22.2 R72.1
N$189: C122.1 C172.1 R72.2 R122.1
N$192: C21.1 C71.1 R21.2 R71.1
N$193: C121.1 C171.1 R71.2 R121.1
N$196: C24.1 C74.1 R24.2 R74.1
N$197: C124.1 C174.1 R74.2 R124.1
N$200: C23.1 C73.1 R23.2 R73.1
N$201: C123.1 C173.1 R73.2 R123.1
N$204: C26.1 C76.1 R26.2 R76.1
N$205: C126.1 C176.1 R76.2 R126.1
N$208: C25.1 C75.1 R25.2 R75.1
N$209: C125.1 C175.1 R75.2 R125.1
N$212: C28.1 C78.1 R28.2 R78.1
N$213: C128.1 C178.1 R78.2 R128.1
N$216: C27.1 C77.1 R27.2 R77.1
N$217: C127.1 C177.1 R77.2 R127.1
N$220: C30.1 C80.1 R30.2 R80.1
N$221: C130.1 C180.1 R80.2 R130.1
N$224: C29.1 C79.1 R29.2 R79.1
N$225: C129.1 C179.1 R79.2 R129.1
Unconnected: J1.51 J2.1

## Library data of the parts
C1-C300 = resistor:C-US: CAPACITOR, American symbol
J1 J2 = Molex - 502598-5193:MOLEX_502598-5193: MOLX-502598-5193; CIIVA_IDS: 8412513; CIRCUITS_LOADED: 51; COMPONENT_LINK_1_DESCRIPTION: Manufacturer URL; COMPONENT_LINK_1_URL: http://www.molex.com/molex/index.jsp; COMPONENT_LINK_3_DESCRIPTION: Package Specification; COMPONENT_LINK_3_URL: http://www.molex.com/pdm_docs/sd/5025985193_sd.pdf; CONTACT_POSITION: Dual; CURRENT_MAX_PER_CONTACT: 0.2A; DATASHEET: http://www.molex.com/webdocs/datasheets/pdf/en-us/5025985193_FFC_FPC_CONNECTORS.pdf; DURABILITY_MATING_CYCLES_MAX: 10; ENTRY_ANGLE: 90degrees Angle; FOOTPRINT_VARIANT_NAME_0: Manufacturer Recommended; IMPORTED: yes; IMPORTED_FROM: vault; IMPORT_TS: 1521860080; MATED_HEIGHT: 1.15mm; MATERIAL___METAL: Copper Alloy, Phosphor Bronze; MATERIAL___PLATING_MATING: Gold; MATERIAL___PLATING_TERMINATION: Gold, Tin; MF: Molex; MOUNTING_TECHNOLOGY: Surface Mount; MPN: 502598-5193; NUMBER_OF_ROWS: 1; ORIENTATION: Right Angle; PACKAGE: 502598-5193; PACKAGE_DESCRIPTION: 51-Lead FPC Connector, Pitch 0.3 mm; PACKAGE_VERSION: Rev. B, 08/2013; PACKING: Tape and Reel; PCB_LOCATOR: No; PCB_RETENTION: Yes; PITCH___MATING_INTERFACE: 0.30mm; POLARIZED_TO_PCB: Yes; PREFIX: J; RELEASE_DATE: 1411372322; ROHS: Yes; STACKABLE: No; VAULT_GUID: 79943B7E-3FDB-4B6C-B1B1-74E826A886CC; VAULT_REVISION: 2B392736-9C86-4257-9195-559BF0CEA94B; VOLTAGE_MAX: 50V AC (RMS)/DC
R1-R150 = resistor:R-US_: RESISTOR, American symbol